# Altium schematic sheet Dogfish3D - MOSFETs and Driver.SchDoc
size A
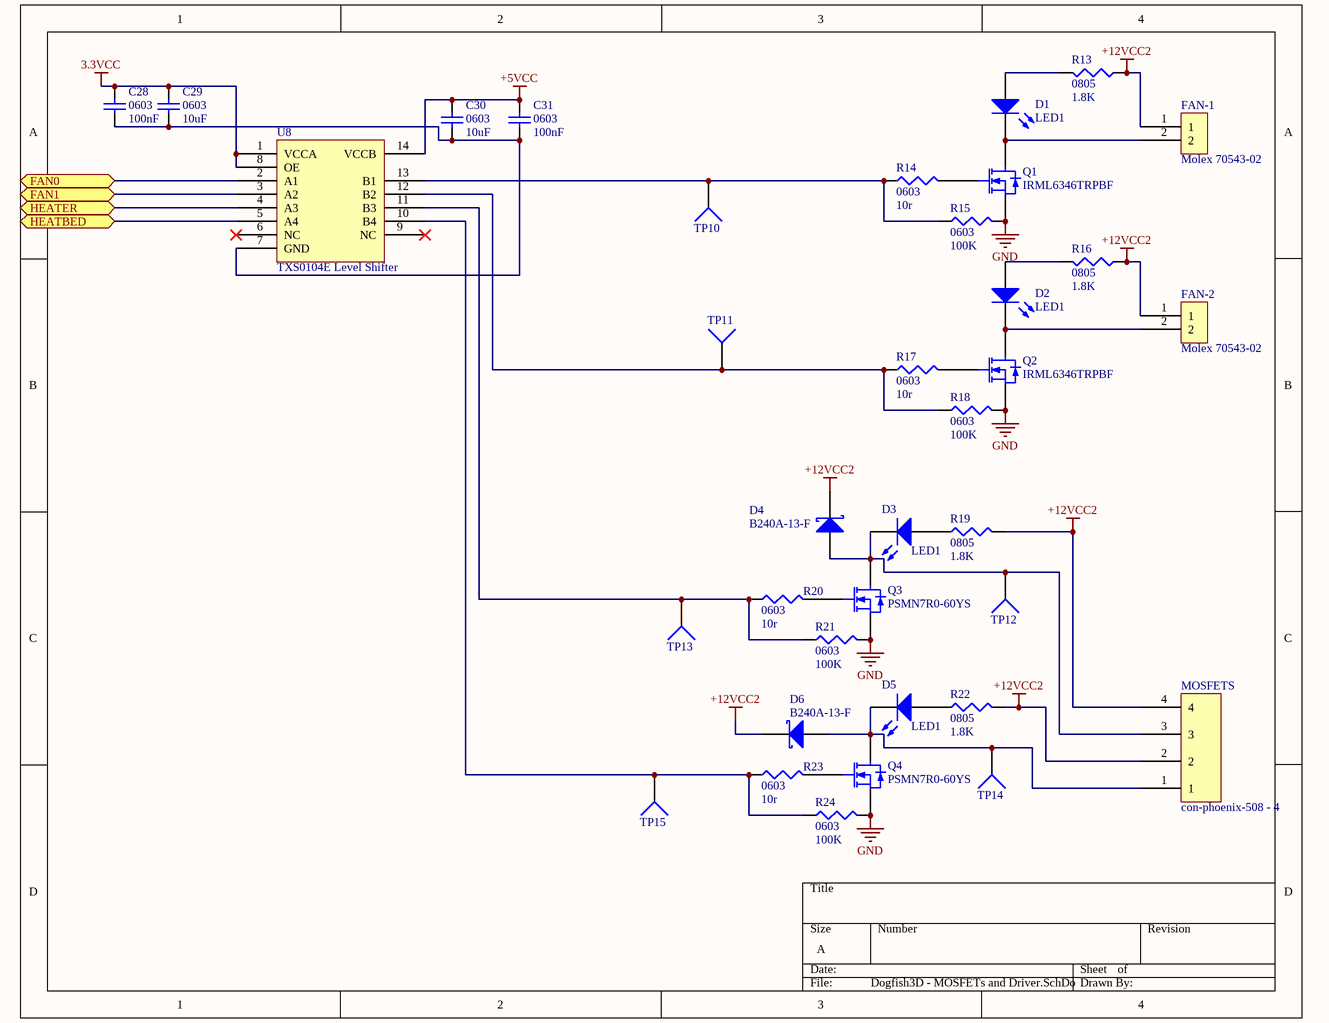
[diagram p0: Dogfish3D - MOSFETs and Driver.SchDoc]

## Parts
C28  0603  value 100nF  [1608[0603]]
C29  0603  value 10uF  [1608[0603]]
C30  0603  value 10uF  [1608[0603]]
C31  0603  value 100nF  [1608[0603]]
D1  LED1  [SM 0805 polarized]
D2  LED1  [SM 0805 polarized]
D3  LED1  [SM 0805 polarized]
D4  B240A-13-F  [SK310A-TP]
D5  LED1  [SM 0805 polarized]
D6  B240A-13-F  [SK310A-TP]
FAN-1  Molex 70543-02  [70543-02]
FAN-2  Molex 70543-02  [70543-02]
MOSFETS  con-phoenix-508 - 4  [MSTBV4]
Q1  IRML6346TRPBF  [IRLML6346]
Q2  IRML6346TRPBF  [IRLML6346]
Q3  PSMN7R0-60YS  [PSMN7R0-60YS]
Q4  PSMN7R0-60YS  [PSMN7R0-60YS]
R13  0805  value 1.8K  [SM 0805 - gap trimmed]
R14  0603  value 10r  [J1-0603]
R15  0603  value 100K  [J1-0603]
R16  0805  value 1.8K  [SM 0805 - gap trimmed]
R17  0603  value 10r  [J1-0603]
R18  0603  value 100K  [J1-0603]
R19  0805  value 1.8K  [SM 0805 - gap trimmed]
R20  0603  value 10r  [J1-0603]
R21  0603  value 100K  [J1-0603]
R22  0805  value 1.8K  [SM 0805 - gap trimmed]
R23  0603  value 10r  [J1-0603]
R24  0603  value 100K  [J1-0603]
TP10  TP4  [TP-2]  (value not drawn)
TP11  TP4  [TP-2]  (value not drawn)
TP12  TP4  [TP-2]  (value not drawn)
TP13  TP4  [TP-2]  (value not drawn)
TP14  TP4  [TP-2]  (value not drawn)
TP15  TP4  [TP-2]  (value not drawn)
U8  TXS0104E Level Shifter  [RGY  (S-PVQFN-N14)]

## Ports
FAN0, FAN1, HEATBED, HEATER

## Nets
3.3VCC: C28.2 C29.2 U8.1(VCCA) U8.8(OE)
+5VCC: C30.2 C31.2 U8.14(VCCB)
+12VCC2: D4.2(K) D6.2(K) FAN-1.1 FAN-2.1 MOSFETS.2 MOSFETS.4 R13.1 R16.1 R19.2 R22.2
GND: Q1.2(S) Q2.2(S) Q3.1(S) Q3.2(S) Q3.3(S) Q4.1(S) Q4.2(S) Q4.3(S) R15.2 R18.2 R21.2 R24.2
FAN0: U8.2(A1) ; port FAN0
FAN1: U8.3(A2) ; port FAN1
HEATBED: U8.5(A4) ; port HEATBED
HEATER: U8.4(A3) ; port HEATER
NetC28_1: C28.1 C29.1 C30.1 C31.1 U8.7(GND)
NetD1_1: D1.1(A) FAN-1.2 Q1.3(D)
NetD1_2: D1.2(K) R13.2
NetD2_1: D2.1(A) FAN-2.2 Q2.3(D)
NetD2_2: D2.2(K) R16.2
NetD3_1: D3.1(A) D4.1(A) MOSFETS.3 Q3.5(D) TP12.1
NetD3_2: D3.2(K) R19.1
NetD5_1: D5.1(A) D6.1(A) MOSFETS.1 Q4.5(D) TP14.1
NetD5_2: D5.2(K) R22.1
NetQ1_1: Q1.1(G) R14.2
NetQ2_1: Q2.1(G) R17.2
NetQ3_4: Q3.4(G) R20.2
NetQ4_4: Q4.4(G) R23.2
NetR14_1: R14.1 R15.1 TP10.1 U8.13(B1)
NetR17_1: R17.1 R18.1 TP11.1 U8.12(B2)
NetR20_1: R20.1 R21.1 TP13.1 U8.11(B3)
NetR23_1: R23.1 R24.1 TP15.1 U8.10(B4)

Not connected (* = marked no-connect by the designer): U8 6(NC)* 9(NC)*

## Library data of the parts
C28-C31 = Cap Semi: Capacitor (Semiconductor SIM Model); Published: 8-Jun-2000; LatestRevisionDate: 29-May-2009; LatestRevisionNote: IPC-7351 Footprint Added.; PackageReference: C1206; Publisher: Altium Limited; PackageDescription: Chip Capacitor
D1-D3 D5 = LED1: Typical RED GaAs LED; Published: 8-Jun-2000; LatestRevisionDate: 08-Jul-2005; LatestRevisionNote: Mech Layer 1 removed.; PackageReference: LED-1; Publisher: Altium Limited; PackageDescription: LED; 2 Leads
D4 D6 = D Schottky: Schottky Diode; Published: 8-Jun-2000; LatestRevisionDate: 17-Jul-2002; LatestRevisionNote: Re-released for DXP Platform.; PackageReference: SMB; Publisher: Altium Limited; PackageDescription: DO-214-AA/SMB; 2 C-Bend Leads; Body 5.3 x 3.6 mm, inc. leads (LxW); Code_JEDEC: DO-214-AA
MOSFETS = con-phoenix-508_4
Q1 Q2 = IRML6346TRPBF: N-Channel MOSFET; Published: 8-Jun-2000; LatestRevisionDate: 17-Jul-2002; LatestRevisionNote: Re-released for DXP Platform.; PackageVersion: 1995/1996; PackageReference: E3; Publisher: Altium Limited; PackageDescription: TO, Flat Index; 3 In-Line, Axial Leads; Body Dia. 4.6mm; Lead Dia. 0.5 mm (max)
Q3 Q4 = PSMN7R0-60YS: N-Channel MOSFET; Published: 8-Jun-2000; LatestRevisionDate: 17-Jul-2002; LatestRevisionNote: Re-released for DXP Platform.; PackageVersion: 1995/1996; PackageReference: E3; Publisher: Altium Limited; PackageDescription: TO, Flat Index; 3 In-Line, Axial Leads; Body Dia. 4.6mm; Lead Dia. 0.5 mm (max)
R13-R24 = Res3: Resistor; Published: 8-Jun-2000; LatestRevisionDate: 29-May-2009; LatestRevisionNote: IPC-7351 Footprint Added.; PackageReference: J1-0603; Publisher: Altium Limited; PackageDescription: Chip Resistor
TP10-TP15 = Socket: LatestRevisionDate: 17-Jul-2002; LatestRevisionNote: Re-released for DXP Platform.; Publisher: Altium Limited
U8 = TXS0104E: TXS0104E - Bidriectional Opendrain/pushpull level shift